# Altium schematic sheet 11 Power-DC IN.SchDoc: CM4 IO
size 420 x 297 mm; Page Create Date: March  8, 1995; Page Number: 11; Page Size: A3; Comment: radxa_1010; Page Count: 19; RevCode: V1.10; Doc: 11 Power-DC IN; DsnPath: D:\WMS\黄工\[RC126]CM4_IO_V1.10\[RC126]_V1.10\CM4 IO_V1.10.DSN; SchematicName: CM4 IO V1.10; PageName: 11 Power-DC IN; PageSize: A3; TopSchematic: True
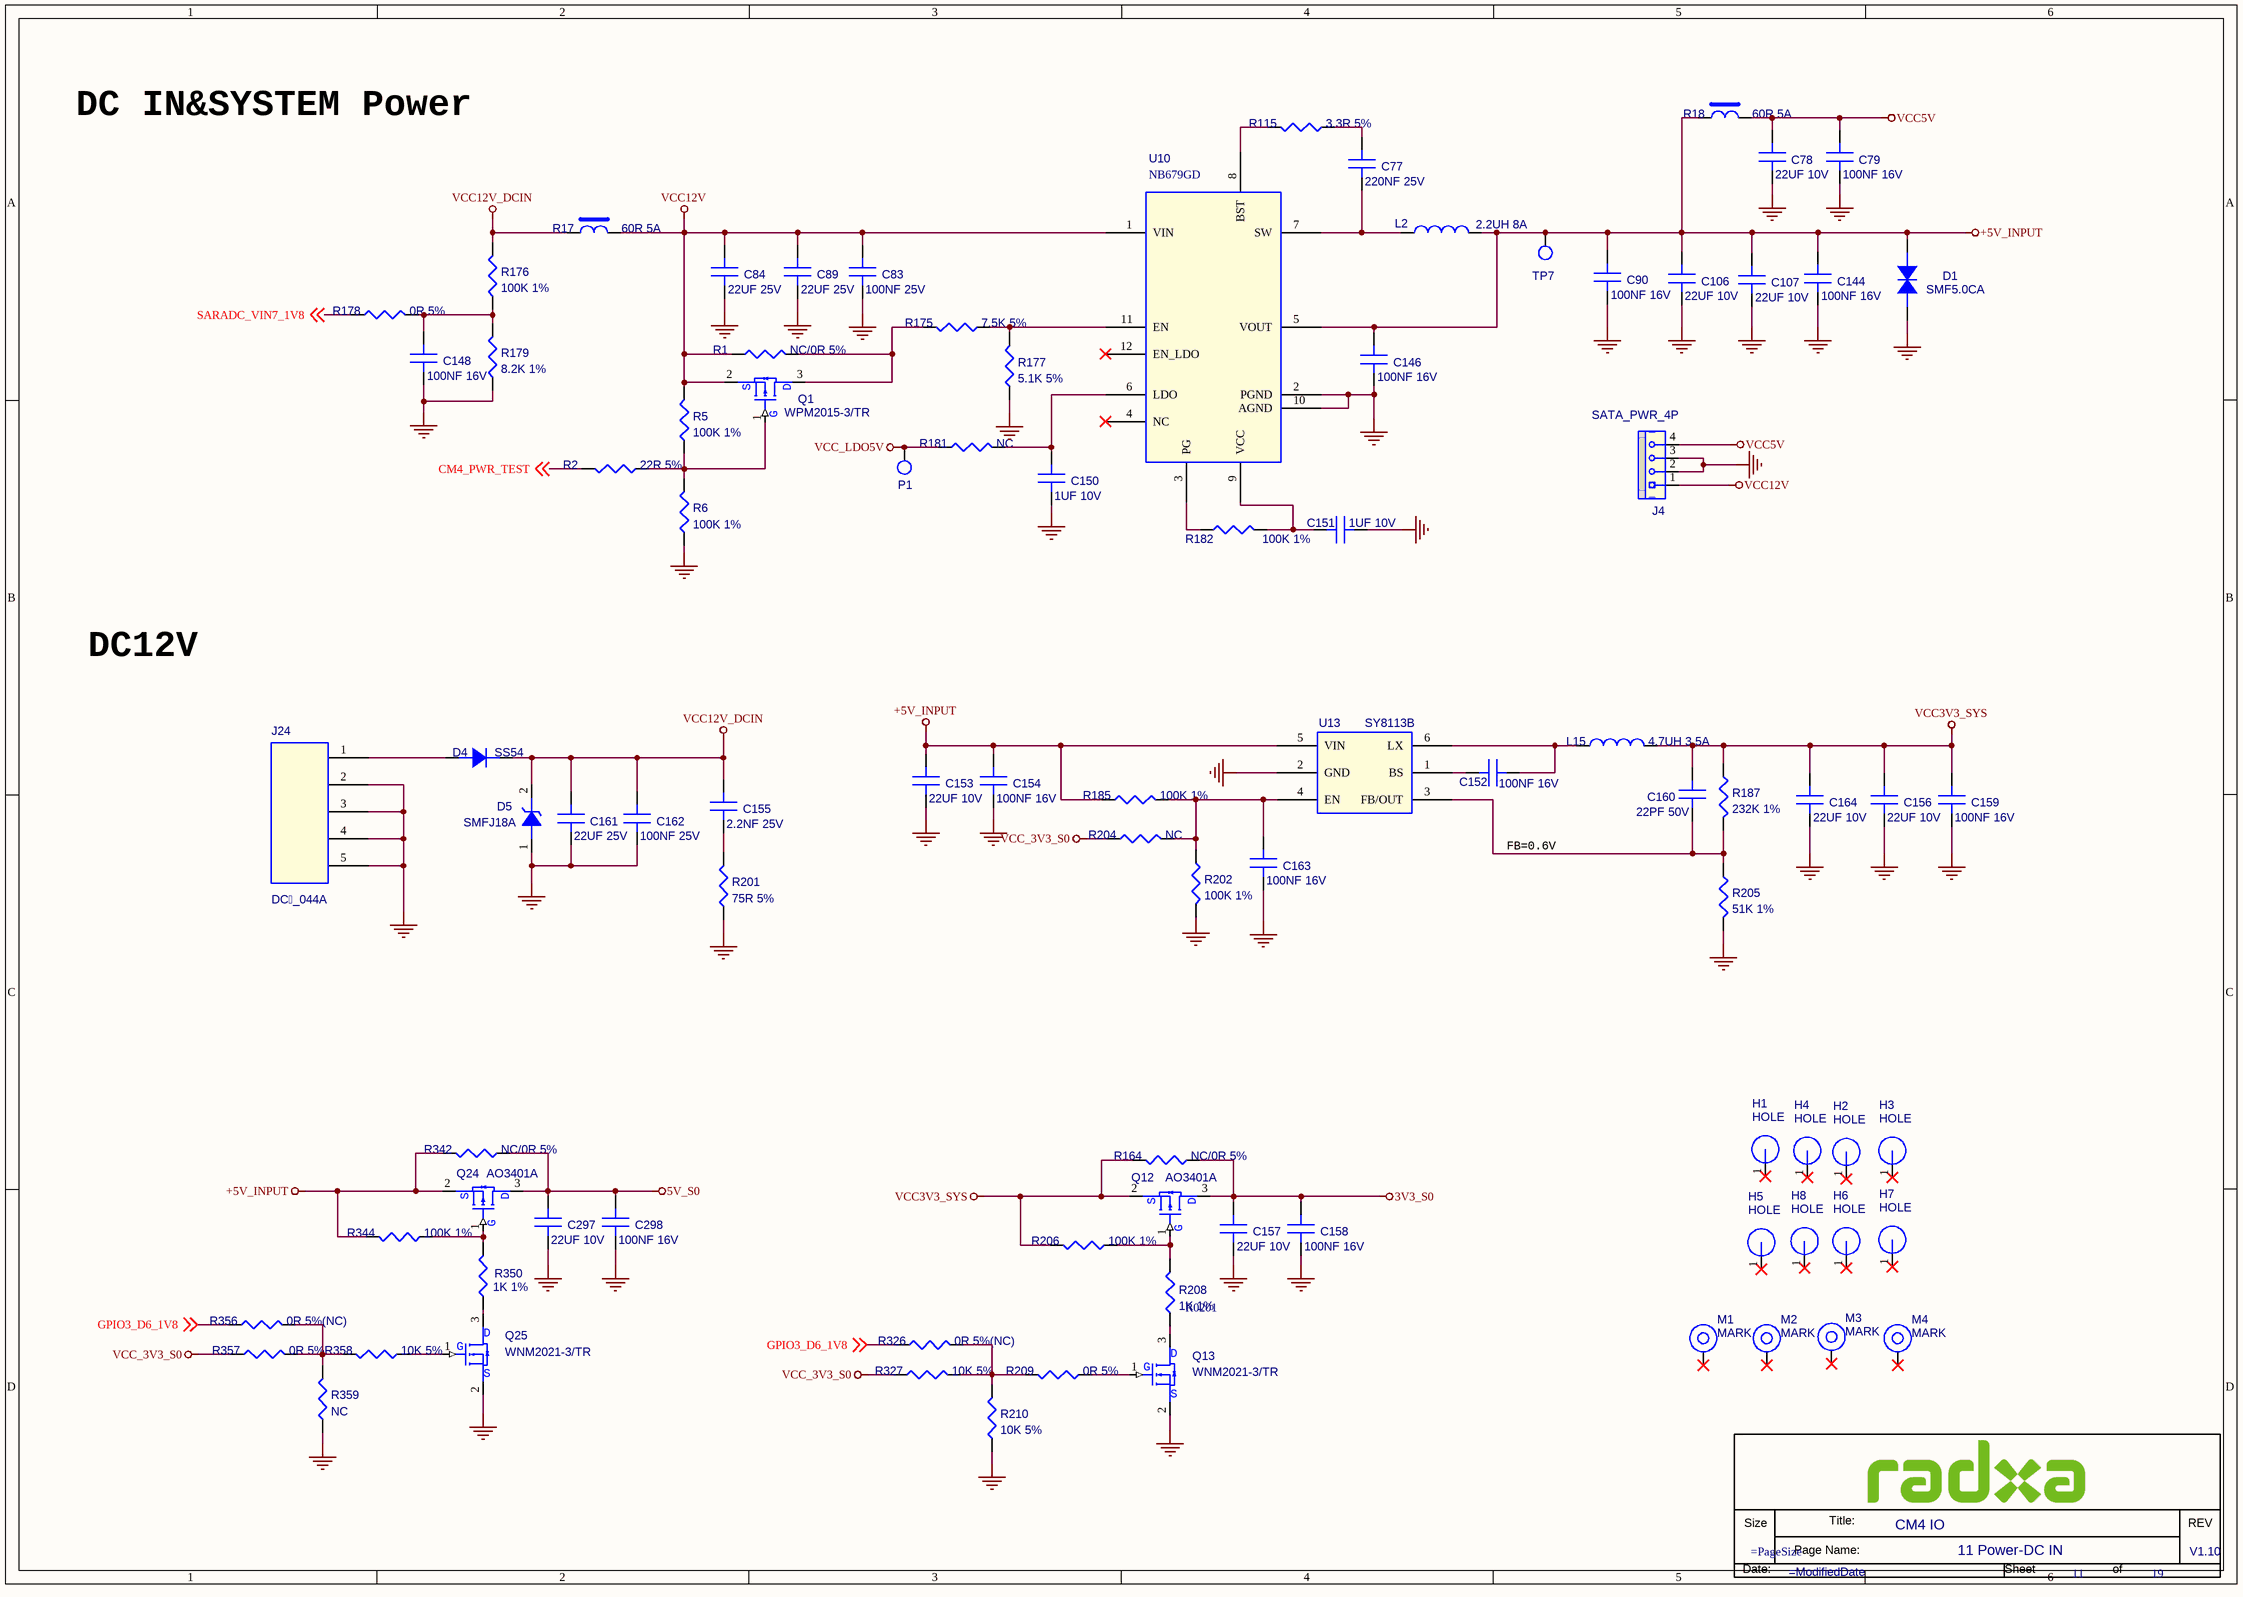
[diagram p0: 11 Power-DC IN.SchDoc]

## Parts
*  Doc: 11 Power-DC IN  RevCode: V1.10  Title: CM4 IO  Page Number: 11  Page Count: 19  (hidden comment: radxa_1010)  (graphical)
C77  220NF 25V  [C0201]
C78  22UF 10V  [C0603]
C79  100NF 16V  [C0201]
C83  100NF 25V  [C0201]
C84  22UF 25V  [C0805]
C89  22UF 25V  [C0805]
C90  100NF 16V  [C0201]
C106  22UF 10V  [C0603]
C107  22UF 10V  [C0603]
C144  100NF 16V  [C0201]
C146  100NF 16V  [C0201]
C148  100NF 16V  [C0201]
C150  1UF 10V  [C0201]
C151  1UF 10V  [C0201]
C152  100NF 16V  [C0201]
C153  22UF 10V  [C0603]
C154  100NF 16V  [C0201]
C155  2.2NF 25V  [C0201]
C156  22UF 10V  [C0603]
C157  22UF 10V  [C0603]
C158  100NF 16V  [C0201]
C159  100NF 16V  [C0201]
C160  22PF 50V  [C0201]
C161  22UF 25V  [C0805]
C162  100NF 25V  [C0201]
C163  100NF 16V  [C0201]
C164  22UF 10V  [C0603]
C297  22UF 10V  [C0603]
C298  100NF 16V  [C0201]
D1  SMF5.0CA  [SOD_123]
D4  SS54  [DO_214AC]
D5  SMFJ18A  [SOD_123]
H1  HOLE  [H3.8MM]
H2  HOLE  [H3.8MM]
H3  HOLE  [H3.8MM]
H4  HOLE  [H3.8MM]
H5  HOLE  [H3.8MM]
H6  HOLE  [H3.8MM]
H7  HOLE  [H3.8MM]
H8  HOLE  [H3.8MM]
J4  SATA_PWR_4P  [CON_TH1X4_2D54_SATA]
J24  DC_044A  [DC_TH5_12X10]
L2  2.2UH 8A  [L_6050]
L15  4.7UH 3.5A  [L_5020]
M1  MARK  [MARK]
M2  MARK  [MARK]
M3  MARK  [MARK]
M4  MARK  [MARK]
P1  TEST  [TEST]  (value not drawn)
Q1  WPM2015-3/TR  [SOT_23]
Q12  AO3401A  [SOT_23]
Q13  WNM2021-3/TR  [SOT_323]
Q24  AO3401A  [SOT_23]
Q25  WNM2021-3/TR  [SOT_323]
R1  NC/0R 5%  [R0402]
R2  22R 5%  [R0402]
R5  100K 1%  [R0402]
R6  100K 1%  [R0402]
R17  60R 5A  [FB1206]
R18  60R 5A  [FB1206]
R115  3.3R 5%  [R0402]
R164  NC/0R 5%  [R0402]
R175  7.5K 5%  [R0402]
R176  100K 1%  [R0402]
R177  5.1K 5%  [R0402]
R178  0R 5%  [R0402]
R179  8.2K 1%  [R0402]
R181  NC  [R0402]
R182  100K 1%  [R0402]
R185  100K 1%  [R0402]
R187  232K 1%  [R0402]
R201  75R 5%  [R0402]
R202  100K 1%  [R0402]
R204  NC  [R0402]
R205  51K 1%  [R0402]
R206  100K 1%  [R0402]
R208  1K 1%  PCB Footprint: R0201  [R0402]
R209  0R 5%  [R0402]
R210  10K 5%  [R0402]
R326  0R 5%(NC)  [R0402]
R327  10K 5%  [R0402]
R342  NC/0R 5%  [R0402]
R344  100K 1%  [R0402]
R350  1K 1%  [R0402]
R356  0R 5%(NC)  [R0402]
R357  0R 5%  [R0402]
R358  10K 5%  [R0402]
R359  NC  [R0402]
TP7  TP_0.7  [TEST]  (value not drawn)
U10  NB679GD  [QFN12_0D5_2]
U13  SY8113B  [SOT23_6]

## Nets
3V3_S0: C157.1(A) C158.1(A) Q12.3(D) R164.1
5V_S0: C297.1(A) C298.1(A) Q24.3(D) R342.1
+5V_INPUT: C90.1(A) C106.1(A) C107.1(A) C144.1(A) C146.1(A) C153.1(A) C154.1(A) D1.2(CATHODE) L2.2 Q24.2(S) R18.1 R185.1 R342.2 R344.2 TP7.1 U10.5(VOUT) U13.5(VIN)
GND: C78.2(B) C79.2(B) C83.2(B) C84.2(B) C89.2(B) C90.2(B) C106.2(B) C107.2(B) C144.2(B) C146.2(B) C148.2(B) C150.2(B) C151.2(B) C153.2(B) C154.2(B) C156.2(B) C157.2(B) C158.2(B) C159.2(B) C161.1(A) C162.2(B) C163.2(B) C164.2(B) C297.2(B) C298.2(B) D1.1(ANODE) D5.1(ANODE) J4.2 J4.3 J24.2 J24.3 J24.4 J24.5 Q13.2(S) Q25.2(S) R6.1 R177.1 R179.1 R201.1 R202.2 R205.2 R210.2 R359.2 U10.2(PGND) U10.10(AGND) U13.2(GND)
VCC3V3_SYS: C156.1(A) C159.1(A) C160.1(A) C164.1(A) L15.2 Q12.2(S) R164.2 R187.1 R206.2
VCC5V: C78.1(A) C79.1(A) J4.4 R18.2
VCC12V: C83.1(A) C84.1(A) C89.1(A) J4.1 Q1.2(S) R1.1 R5.2 R17.2 U10.1(VIN)
VCC12V_DCIN: C155.1(A) C161.2(B) C162.1(A) D4.2(K) D5.2(CATHODE) R17.1 R176.2
VCC_3V3_S0: R204.1 R327.1 R357.1
VCC_LDO5V: P1.1 R181.1
CM4_PWR_TEST: R2.1 ; off-sheet CM4_PWR_TEST
GPIO3_D6_1V8: R326.1 R356.1 ; off-sheet GPIO3_D6_1V8
SARADC_VIN7_1V8: R178.1 ; off-sheet SARADC_VIN7_1V8
NetC77_1: C77.1(A) R115.2
NetC77_2: C77.2(B) L2.1 U10.7(SW)
NetC148_1: C148.1(A) R176.1 R178.2 R179.2
NetC150_1: C150.1(A) R181.2 U10.6(LDO)
NetC151_1: C151.1(A) R182.2 U10.9(VCC)
NetC152_1: C152.1(A) U13.1(BS)
NetC152_2: C152.2(B) L15.1 U13.6(LX)
NetC155_2: C155.2(B) R201.2
NetC160_2: C160.2(B) R187.2 R205.1 U13.3(FB/OUT)
NetC163_1: C163.1(A) R185.2 R202.1 R204.2 U13.4(EN)
NetD4_1: D4.1(A) J24.1
NetQ1_1: Q1.1(G) R2.2 R5.1 R6.2
NetQ1_3: Q1.3(D) R1.2 R175.2
NetQ12_1: Q12.1(G) R206.1 R208.1
NetQ13_1: Q13.1(G) R209.1
NetQ13_3: Q13.3(D) R208.2
NetQ24_1: Q24.1(G) R344.1 R350.1
NetQ25_1: Q25.1(G) R358.1
NetQ25_3: Q25.3(D) R350.2
NetR115_1: R115.1 U10.8(BST)
NetR175_1: R175.1 R177.2 U10.11(EN)
NetR182_1: R182.1 U10.3(PG)
NetR209_2: R209.2 R210.1 R326.2 R327.2
NetR356_2: R356.2 R357.2 R358.2 R359.1

Not connected (* = marked no-connect by the designer): H1 1*; H2 1*; H3 1*; H4 1*; H5 1*; H6 1*; H7 1*; H8 1*; M1 1*; M2 1*; M3 1*; M4 1*; U10 4(NC)* 12(EN_LDO)*

## Notes on the sheet
- DC IN&SYSTEM Power
- DC12V
- FB=0.6V
- (in symbol radxa_1010) Size; Title:; REV; Page Name:; Date:; Sheet; of

## Library data of the parts
C77 = C: SMD  0201  220NF  25V  X5R  ±10%  ROHS; PARTS: 1; Part Reference: C77; Part Number: A1C01.00365; OriginalSymbolOrigin: (0,30); PKG_TYPE: CAP2-100-250; LEVEL: STD; PINSWAP: (A,B); Preferred: 6715f349cd0bc5; Value: 220NF 25V; Part Type: 陶瓷电容; PCB Footprint: C0201
C78 = C: SMD  0603  22UF  10V  X5R  ±20%  ROHS; PARTS: 1; Part Reference: C78; Part Number: A1C01.00015; OriginalSymbolOrigin: (0,30); PKG_TYPE: CAP2-100-250; LEVEL: STD; PINSWAP: (A,B); Preferred: 6715f349cd0bc5; Value: 22UF 10V; Part Type: 陶瓷电容; PCB Footprint: C0603
C79 = C: SMD  0201  100NF  16V  X5R  ±20%  ROHS; PARTS: 1; Part Reference: C79; Part Number: A1C01.00099; OriginalSymbolOrigin: (0,30); PKG_TYPE: CAP2-100-250; LEVEL: STD; PINSWAP: (A,B); Preferred: 6715f349cd0bc5; Value: 100NF 16V; Part Type: 陶瓷电容; PCB Footprint: C0201
C83 = C: SMD  0201  100NF  25V  X5R  ±20%  ROHS; PARTS: 1; Part Reference: C83; Part Number: A1C01.00101; OriginalSymbolOrigin: (0,30); PKG_TYPE: CAP2-100-250; LEVEL: STD; PINSWAP: (A,B); Preferred: 6715f349cd0bc5; Value: 100NF 25V; Part Type: 陶瓷电容; PCB Footprint: C0201
C84 = C: SMD  0805  22UF  25V  X5R  ±20%  ROHS; PARTS: 1; Part Reference: C84; Part Number: A1C01.00249; OriginalSymbolOrigin: (0,30); PKG_TYPE: CAP2-100-250; LEVEL: STD; PINSWAP: (A,B); Preferred: 6715f349cd0bc5; Value: 22UF 25V; Part Type: 陶瓷电容; PCB Footprint: C0805
C89 = C: SMD  0805  22UF  25V  X5R  ±20%  ROHS; PARTS: 1; Part Reference: C89; Part Number: A1C01.00249; OriginalSymbolOrigin: (0,30); PKG_TYPE: CAP2-100-250; LEVEL: STD; PINSWAP: (A,B); Preferred: 6715f349cd0bc5; Value: 22UF 25V; Part Type: 陶瓷电容; PCB Footprint: C0805
C90 = C: SMD  0201  100NF  16V  X5R  ±20%  ROHS; PARTS: 1; Part Reference: C90; Part Number: A1C01.00099; OriginalSymbolOrigin: (0,30); PKG_TYPE: CAP2-100-250; LEVEL: STD; PINSWAP: (A,B); Preferred: 6715f349cd0bc5; Value: 100NF 16V; Part Type: 陶瓷电容; PCB Footprint: C0201
C106 = C: SMD  0603  22UF  10V  X5R  ±20%  ROHS; PARTS: 1; Part Reference: C106; Part Number: A1C01.00015; OriginalSymbolOrigin: (0,30); PKG_TYPE: CAP2-100-250; LEVEL: STD; PINSWAP: (A,B); Preferred: 6715f349cd0bc5; Value: 22UF 10V; Part Type: 陶瓷电容; PCB Footprint: C0603
C107 = C: SMD  0603  22UF  10V  X5R  ±20%  ROHS; PARTS: 1; Part Reference: C107; Part Number: A1C01.00015; OriginalSymbolOrigin: (0,30); PKG_TYPE: CAP2-100-250; LEVEL: STD; PINSWAP: (A,B); Preferred: 6715f349cd0bc5; Value: 22UF 10V; Part Type: 陶瓷电容; PCB Footprint: C0603
C144 = C: SMD  0201  100NF  16V  X5R  ±20%  ROHS; PARTS: 1; Part Reference: C144; Part Number: A1C01.00099; OriginalSymbolOrigin: (0,30); PKG_TYPE: CAP2-100-250; LEVEL: STD; PINSWAP: (A,B); Preferred: 6715f349cd0bc5; Value: 100NF 16V; Part Type: 陶瓷电容; PCB Footprint: C0201
C146 = C: SMD  0201  100NF  16V  X5R  ±20%  ROHS; PARTS: 1; Part Reference: C146; Part Number: A1C01.00099; OriginalSymbolOrigin: (0,30); PKG_TYPE: CAP2-100-250; LEVEL: STD; PINSWAP: (A,B); Preferred: 6715f349cd0bc5; Value: 100NF 16V; Part Type: 陶瓷电容; PCB Footprint: C0201
C148 = C: SMD  0201  100NF  16V  X5R  ±20%  ROHS; PARTS: 1; Part Reference: C148; Part Number: A1C01.00099; OriginalSymbolOrigin: (0,30); PKG_TYPE: CAP2-100-250; LEVEL: STD; PINSWAP: (A,B); Preferred: 6715f349cd0bc5; Value: 100NF 16V; Part Type: 陶瓷电容; PCB Footprint: C0201
C150 = C: SMD  0201  1UF  10V  X5R  ±20%  ROHS; PARTS: 1; Part Reference: C150; Part Number: A1C01.00081; OriginalSymbolOrigin: (0,30); PKG_TYPE: CAP2-100-250; LEVEL: STD; PINSWAP: (A,B); Preferred: 6715f349cd0bc5; Value: 1UF 10V; Part Type: 陶瓷电容; PCB Footprint: C0201
C151 = C: SMD  0201  1UF  10V  X5R  ±20%  ROHS; PARTS: 1; Part Reference: C151; Part Number: A1C01.00081; OriginalSymbolOrigin: (0,30); PKG_TYPE: CAP2-100-250; LEVEL: STD; PINSWAP: (A,B); Preferred: 6715f349cd0bc5; Value: 1UF 10V; Part Type: 陶瓷电容
C152 = C: SMD  0201  100NF  16V  X5R  ±20%  ROHS; PARTS: 1; Part Reference: C152; Part Number: A1C01.00099; OriginalSymbolOrigin: (0,30); PKG_TYPE: CAP2-100-250; LEVEL: STD; PINSWAP: (A,B); Preferred: 6715f349cd0bc5; Value: 100NF 16V; Part Type: 陶瓷电容; PCB Footprint: C0201
C153 = C: SMD  0603  22UF  10V  X5R  ±20%  ROHS; PARTS: 1; Part Reference: C153; Part Number: A1C01.00015; OriginalSymbolOrigin: (0,30); PKG_TYPE: CAP2-100-250; LEVEL: STD; PINSWAP: (A,B); Preferred: 6715f349cd0bc5; Value: 22UF 10V; Part Type: 陶瓷电容; PCB Footprint: C0603
C154 = C: SMD  0201  100NF  16V  X5R  ±20%  ROHS; PARTS: 1; Part Reference: C154; Part Number: A1C01.00099; OriginalSymbolOrigin: (0,30); PKG_TYPE: CAP2-100-250; LEVEL: STD; PINSWAP: (A,B); Preferred: 6715f349cd0bc5; Value: 100NF 16V; Part Type: 陶瓷电容; PCB Footprint: C0201
C155 = C: SMD  0201  2.2NF  25V  X7R  ±10%  ROHS; PARTS: 1; Part Reference: C155; Part Number: A1C01.00123; OriginalSymbolOrigin: (0,30); PKG_TYPE: CAP2-100-250; LEVEL: STD; PINSWAP: (A,B); Preferred: 6715f349cd0bc5; Value: 2.2NF 25V; Part Type: 陶瓷电容; PCB Footprint: C0201
C156 = C: SMD  0603  22UF  10V  X5R  ±20%  ROHS; PARTS: 1; Part Reference: C156; Part Number: A1C01.00015; OriginalSymbolOrigin: (0,30); PKG_TYPE: CAP2-100-250; LEVEL: STD; PINSWAP: (A,B); Preferred: 6715f349cd0bc5; Value: 22UF 10V; Part Type: 陶瓷电容; PCB Footprint: C0603
C157 = C: SMD  0603  22UF  10V  X5R  ±20%  ROHS; PARTS: 1; Part Reference: C157; Part Number: A1C01.00015; OriginalSymbolOrigin: (0,30); PKG_TYPE: CAP2-100-250; LEVEL: STD; PINSWAP: (A,B); Preferred: 6715f349cd0bc5; Value: 22UF 10V; Part Type: 陶瓷电容; PCB Footprint: C0603
C158 = C: SMD  0201  100NF  16V  X5R  ±20%  ROHS; PARTS: 1; Part Reference: C158; Part Number: A1C01.00099; OriginalSymbolOrigin: (0,30); PKG_TYPE: CAP2-100-250; LEVEL: STD; PINSWAP: (A,B); Preferred: 6715f349cd0bc5; Value: 100NF 16V; Part Type: 陶瓷电容; PCB Footprint: C0201
C159 = C: SMD  0201  100NF  16V  X5R  ±20%  ROHS; PARTS: 1; Part Reference: C159; Part Number: A1C01.00099; OriginalSymbolOrigin: (0,30); PKG_TYPE: CAP2-100-250; LEVEL: STD; PINSWAP: (A,B); Preferred: 6715f349cd0bc5; Value: 100NF 16V; Part Type: 陶瓷电容; PCB Footprint: C0201
C160 = C: SMD  0201  22PF  50V  NPO  ±5%  ROHS; PARTS: 1; Part Reference: C160; Part Number: A1C01.00021; OriginalSymbolOrigin: (0,30); PKG_TYPE: CAP2-100-250; LEVEL: STD; PINSWAP: (A,B); Preferred: 6715f349cd0bc5; Value: 22PF 50V; Part Type: 陶瓷电容; PCB Footprint: C0201
C161 = C: SMD  0805  22UF  25V  X5R  ±20%  ROHS; PARTS: 1; Part Reference: C161; Part Number: A1C01.00249; OriginalSymbolOrigin: (0,30); PKG_TYPE: CAP2-100-250; LEVEL: STD; PINSWAP: (A,B); Preferred: 6715f349cd0bc5; Value: 22UF 25V; Part Type: 陶瓷电容; PCB Footprint: C0805
C162 = C: SMD  0201  100NF  25V  X5R  ±20%  ROHS; PARTS: 1; Part Reference: C162; Part Number: A1C01.00101; OriginalSymbolOrigin: (0,30); PKG_TYPE: CAP2-100-250; LEVEL: STD; PINSWAP: (A,B); Preferred: 6715f349cd0bc5; Value: 100NF 25V; Part Type: 陶瓷电容; PCB Footprint: C0201
C163 = C: SMD  0201  100NF  16V  X5R  ±20%  ROHS; PARTS: 1; Part Reference: C163; Part Number: A1C01.00099; OriginalSymbolOrigin: (0,30); PKG_TYPE: CAP2-100-250; LEVEL: STD; PINSWAP: (A,B); Preferred: 6715f349cd0bc5; Value: 100NF 16V; Part Type: 陶瓷电容; PCB Footprint: C0201
C164 = C: SMD  0603  22UF  10V  X5R  ±20%  ROHS; PARTS: 1; Part Reference: C164; Part Number: A1C01.00015; OriginalSymbolOrigin: (0,30); PKG_TYPE: CAP2-100-250; LEVEL: STD; PINSWAP: (A,B); Preferred: 6715f349cd0bc5; Value: 22UF 10V; Part Type: 陶瓷电容; PCB Footprint: C0603
C297 = C: SMD  0603  22UF  10V  X5R  ±20%  ROHS; PARTS: 1; Part Reference: C297; Part Number: A1C01.00015; OriginalSymbolOrigin: (0,30); PKG_TYPE: CAP2-100-250; LEVEL: STD; PINSWAP: (A,B); Preferred: 6715f349cd0bc5; Value: 22UF 10V; Part Type: 陶瓷电容; PCB Footprint: C0603
C298 = C: SMD  0201  100NF  16V  X5R  ±20%  ROHS; PARTS: 1; Part Reference: C298; Part Number: A1C01.00099; OriginalSymbolOrigin: (0,30); PKG_TYPE: CAP2-100-250; LEVEL: STD; PINSWAP: (A,B); Preferred: 6715f349cd0bc5; Value: 100NF 16V; Part Type: 陶瓷电容; PCB Footprint: C0201
D1 = DIODE_S: SMD  SOD-123FL  SMF5.0CA  晶导微  ROHS; Part Reference: D1; Part Number: A1D02.00132; Temp Coeff: -55℃ to +150℃; Value: SMF5.0CA; Part Type: 二极管-ESD管-桥堆-TVS管; PCB Footprint: SOD_123
D4 = DIODE: SMD  编带  DO-214AC  SS54  晶导微  ROHS; Part Reference: D4; Manufacturer PN: SS32; Manufacturer: 星海; Part Number: A1D02.00006; Priority: A; ROOM: CHG; Value: SS54; Created by: JJJ; Part Type: 二极管-ESD管-桥堆-TVS管; RK PN: SS32; PCB Footprint: DO_214AC
D5 = TVS: SMD  编带  SOD-123  SMFJ18A  晶导微电子  ROHS; Part Reference: D5; Part Number: A1D02.00007; Preferred: 6715f349cd0bc5; Temp Coeff: -55℃ to +150℃; PCB Footprint: SOD_123; Value: SMFJ18A; Part Type: 二极管-ESD管-桥堆-TVS管
H1 = HOLE: 直径3.5mm hole; Part Reference: H1; PCB Footprint: HOLE_R6_2D7MM; RK PN: HOLE_3R50; Priority: A; Value: HOLE; Part Type: HOLE; Created by: CZD
H2 = HOLE: 直径3.5mm hole; Part Reference: H2; PCB Footprint: HOLE_R6_2D7MM; Priority: A; RK PN: HOLE_3R50; Value: HOLE; Created by: CZD; Part Type: HOLE
H3 = HOLE: 直径3.5mm hole; Part Reference: H3; PCB Footprint: HOLE_R6_2D7MM; Priority: A; RK PN: HOLE_3R50; Value: HOLE; Created by: CZD; Part Type: HOLE
H4 = HOLE: 直径3.5mm hole; Part Reference: H4; PCB Footprint: HOLE_R6_2D7MM; Priority: A; RK PN: HOLE_3R50; Value: HOLE; Created by: CZD; Part Type: HOLE
H5 = HOLE: 直径3.5mm hole; Part Reference: H5; PCB Footprint: HOLE_R6_2D7MM; RK PN: HOLE_3R50; Priority: A; Value: HOLE; Part Type: HOLE; Created by: CZD
H6 = HOLE: 直径3.5mm hole; Part Reference: H6; PCB Footprint: HOLE_R6_2D7MM; RK PN: HOLE_3R50; Priority: A; Value: HOLE; Part Type: HOLE; Created by: CZD
H7 = HOLE: 直径3.5mm hole; Part Reference: H7; PCB Footprint: HOLE_R6_2D7MM; Priority: A; RK PN: HOLE_3R50; Value: HOLE; Created by: CZD; Part Type: HOLE
H8 = HOLE: 直径3.5mm hole; Part Reference: H8; PCB Footprint: HOLE_R6_2D7MM; Priority: A; RK PN: HOLE_3R50; Value: HOLE; Created by: CZD; Part Type: HOLE
J4 = SATA_PWR_4P: DIP  排针座  1*4PIN  180度  无定位柱  2.54mm脚距  针长一端8.3mm  另一端3.5mm  小4PIN  白色  M2545V-4P  兴飞  ROHS; Part Reference: J4; Part Number: A1J01.00014; Value: SATA_PWR_4P; Part Type: 排座
J24 = DC_044A_5520: DIP  5PIN  DS-044BS  内孔Φ6mm  铁芯Φ2.0mm  11.6*10.2*7.3mm  协佳  ROHS; Part Reference: J24; Part Number: A1J11.00007; Temp Coeff: NA; Preferred: 6715f352cd0bcd; Part Type: DC座
L2 = L: SMD  带屏蔽  7.2x6.6x5mm  2.2UH  8A  ±20%  RXWSHC0650-2R2M  仁芯微  ROHS; Part Reference: L2; Part Number: A1L01.00163; Preferred: 6715f349cd0bc5; Temp Coeff: -55℃ to +125℃; PCB Footprint: L_6050; Value: 2.2UH 8A; Part Type: 贴片功率电感
L15 = L: SMD  带屏蔽  5.4*5.2*1.8mm  4.7UH  3.5A  ±20%  RXWSHC0520-4R7M  仁芯微  ROHS; Part Reference: L15; Part Number: A1L01.00071; Preferred: 6715f349cd0bc5; Temp Coeff: -55℃ to +125℃; PCB Footprint: L_5020; Value: 4.7UH 3.5A; Part Type: 贴片功率电感
M1 = MARK: MARK Symble; Part Reference: M1; Priority: A; RK PN: MARK01; PCB Footprint: MARK; Value: MARK; Created by: JJJ; Part Type: MARK
M2 = MARK: MARK Symble; Part Reference: M2; Priority: A; RK PN: MARK01; PCB Footprint: MARK; Value: MARK; Created by: JJJ; Part Type: MARK
M3 = MARK: MARK Symble; Part Reference: M3; RK PN: MARK01; Priority: A; PCB Footprint: MARK; Value: MARK; Part Type: MARK; Created by: JJJ
M4 = MARK: MARK Symble; Part Reference: M4; RK PN: MARK01; Priority: A; PCB Footprint: MARK; Value: MARK; Part Type: MARK; Created by: JJJ
P1 = TESTPOINT1: Part Reference: P1; PCB Footprint: TP_0R70; Value: TEST
Q1 = MOSFET_PNP: SMD编带  SOT-23  WPM2015-3/TR  P沟道  ROHS; Part Reference: Q1; Part Number: A1D01.00019; Temp Coeff: -55℃ to ＋150℃; Value: WPM2015-3/TR; Part Type: 三极管-MOS管; PCB Footprint: SOT_23
Q12 = MOSFET_PNP: SMD  编带  SOT23-3  AO3401A  P沟道  AOS  ROHS; Part Reference: Q12; Part Number: A1D01.00034; Temp Coeff: -55℃ to ＋150℃; Value: AO3401A; Part Type: 三极管-MOS管; PCB Footprint: SOT_23
Q13 = MOSFET_NPN: SMD编带  SOT-323  WILLSEMI(韦尔)  WNM2021-3/TR  N沟道  ROHS; Part Reference: Q13; Part Number: A1D01.00008; Temp Coeff: -55℃ to ＋150℃; Value: WNM2021-3/TR; Part Type: 三极管-MOS管; PCB Footprint: SOT_323
Q24 = MOSFET_PNP: SMD  编带  SOT23-3  AO3401A  P沟道  AOS  ROHS; Part Reference: Q24; Part Number: A1D01.00034; Temp Coeff: -55℃ to ＋150℃; Value: AO3401A; Part Type: 三极管-MOS管; PCB Footprint: SOT_23
Q25 = MOSFET_NPN: SMD编带  SOT-323  WILLSEMI(韦尔)  WNM2021-3/TR  N沟道  ROHS; Part Reference: Q25; Part Number: A1D01.00008; Temp Coeff: -55℃ to ＋150℃; Value: WNM2021-3/TR; Part Type: 三极管-MOS管; PCB Footprint: SOT_323
R1 = R: SMD  0201  0R  1/20W  ±5%  ROHS; Part Reference: R1; Part Number: A1R01.00027; PCB Footprint: R0201; Temp Coeff: -55℃ to +125℃; Preferred: 6715f349cd0bc5; Value: NC/0R 5%; Part Type: 贴片电阻
R2 = R: SMD  0201  22R  1/20W  ±5%  ROHS; Part Reference: R2; Part Number: A1R01.00024; PCB Footprint: R0201; Preferred: 6715f349cd0bc5; Temp Coeff: -55℃ to +125℃; Value: 22R 5%; Part Type: 贴片电阻
R5 = R: SMD  0201  100K  1/20W  ±1%  ROHS; Part Reference: R5; Part Number: A1R01.00165; PCB Footprint: R0201; Preferred: 6715f349cd0bc5; Value: 100K 1%; Part Type: 贴片电阻
R6 = R: SMD  0201  100K  1/20W  ±1%  ROHS; Part Reference: R6; Part Number: A1R01.00165; PCB Footprint: R0201; Preferred: 6715f349cd0bc5; Value: 100K 1%; Part Type: 贴片电阻
R17 = BEAD: SMD  1206  FB60R  5A  ±25%  ROHS; Part Reference: R17; Part Number: A1L09.00006; Preferred: 6715f352cd0bcd; Temp Coeff: -40℃ to +105℃; PCB Footprint: FB1206; Value: 60R 5A; Part Type: 贴片磁珠
R18 = BEAD: SMD  1206  FB60R  5A  ±25%  ROHS; Part Reference: R18; Part Number: A1L09.00006; Preferred: 6715f352cd0bcd; Temp Coeff: -40℃ to +105℃; PCB Footprint: FB1206; Value: 60R 5A; Part Type: 贴片磁珠
R115 = R: SMD  0201  3.3R  1/20W  ±5%  ROHS; Part Reference: R115; Part Number: A1R01.00145; PCB Footprint: R0201; Preferred: 6715f349cd0bc5; Temp Coeff: -55℃ to +125℃; Value: 3.3R 5%; Part Type: 贴片电阻
R164 = R: SMD  0402  0R  1/16W  ±5%  ROHS; Part Reference: R164; Part Number: A1R01.00030; Temp Coeff: -55℃ to +155℃; Preferred: 6715f349cd0bc5; PCB Footprint: R0402; Value: NC/0R 5%; Part Type: 贴片电阻
R175 = R: SMD  0201  7.5K  1/20W  ±5%  ROHS; Part Reference: R175; Part Number: A1R01.00495; PCB Footprint: R0201; Temp Coeff: -55℃ to +125℃; Preferred: 6715f349cd0bc5; Value: 7.5K 5%; Part Type: 贴片电阻
R176 = R: SMD  0201  100K  1/20W  ±1%  ROHS; Part Reference: R176; Part Number: A1R01.00165; Preferred: 6715f349cd0bc5; Value: 100K 1%; Part Type: 贴片电阻
R177 = R: SMD  0201  5.1K  1/20W  ±5%  ROHS; Part Reference: R177; Part Number: A1R01.00013; PCB Footprint: R0201; Temp Coeff: -55℃ to +125℃; Preferred: 6715f349cd0bc5; Value: 5.1K 5%; Part Type: 贴片电阻
R178 = R: SMD  0201  0R  1/20W  ±5%  ROHS; Part Reference: R178; Part Number: A1R01.00027; PCB Footprint: R0201; Temp Coeff: -55℃ to +125℃; Preferred: 6715f349cd0bc5; Value: 0R 5%; Part Type: 贴片电阻
R179 = R: SMD  0201  8.2K  1/20W  ±1%  ROHS; Part Reference: R179; Part Number: A1R01.00086; PCB Footprint: R0201; Preferred: 6715f349cd0bc5; Temp Coeff: -55℃ to +125℃; Value: 8.2K 1%; Part Type: 贴片电阻
R181 = R: SMD  0201  0R  1/20W  ±5%  ROHS; Part Reference: R181; Part Number: A1R01.00027; PCB Footprint: R0201; Preferred: 6715f349cd0bc5; Temp Coeff: -55℃ to +125℃; Value: NC; Part Type: 贴片电阻
R182 = R: SMD  0201  100K  1/20W  ±1%  ROHS; Part Reference: R182; Part Number: A1R01.00165; PCB Footprint: R0201; Preferred: 6715f349cd0bc5; Value: 100K 1%; Part Type: 贴片电阻
R185 = R: SMD  0201  100K  1/20W  ±1%  ROHS; Part Reference: R185; Part Number: A1R01.00165; PCB Footprint: R0201; Preferred: 6715f349cd0bc5; Value: 100K 1%; Part Type: 贴片电阻
R187 = R: SMD  0201  232K  1/20W  ±1%  ROHS; Part Reference: R187; Part Number: A1R01.00189; PCB Footprint: R0201; Preferred: 6715f349cd0bc5; Temp Coeff: -55℃ to +125℃; Value: 232K 1%; Part Type: 贴片电阻
R201 = R: SMD  0201  75R  1/20W  ±5%  ROHS; Part Reference: R201; Part Number: A1R01.00395; PCB Footprint: R0201; Temp Coeff: -55℃ to +125℃; Preferred: 6715f349cd0bc5; Value: 75R 5%; Part Type: 贴片电阻
R202 = R: SMD  0201  100K  1/20W  ±1%  ROHS; Part Reference: R202; Part Number: A1R01.00165; PCB Footprint: R0201; Preferred: 6715f349cd0bc5; Value: 100K 1%; Part Type: 贴片电阻
R204 = R: SMD  0201  10K  1/20W  ±5%  ROHS; Part Reference: R204; Part Number: A1R01.00012; PCB Footprint: R0201; Preferred: 6715f349cd0bc5; Temp Coeff: -55℃ to +125℃; Value: NC; Part Type: 贴片电阻
R205 = R: SMD  0201  51K  1/20W  ±1%  ROHS; Part Reference: R205; Part Number: A1R01.00149; PCB Footprint: R0201; Preferred: 6715f349cd0bc5; Temp Coeff: -55℃ to +125℃; Value: 51K 1%; Part Type: 贴片电阻
R206 = R: SMD  0201  100K  1/20W  ±1%  ROHS; Part Reference: R206; Part Number: A1R01.00165; PCB Footprint: R0201; Preferred: 6715f349cd0bc5; Value: 100K 1%; Part Type: 贴片电阻
R208 = R: SMD  0201  1K  1/20W  ±1%  ROHS; Part Reference: R208; Part Number: A1R01.00111; Preferred: 6715f349cd0bc5; Value: 1K 1%; Part Type: 贴片电阻
R209 = R: SMD  0201  10K  1/20W  ±5%  ROHS; Part Reference: R209; Part Number: A1R01.00012; PCB Footprint: R0201; Preferred: 6715f349cd0bc5; Temp Coeff: -55℃ to +125℃; Value: 0R 5%; Part Type: 贴片电阻
R210 = R: SMD  0201  10K  1/20W  ±5%  ROHS; Part Reference: R210; Part Number: A1R01.00012; PCB Footprint: R0201; Preferred: 6715f349cd0bc5; Temp Coeff: -55℃ to +125℃; Value: 10K 5%; Part Type: 贴片电阻
R326 = R: SMD  0201  0R  1/20W  ±5%  ROHS; Part Reference: R326; Part Number: A1R01.00027; PCB Footprint: R0201; Preferred: 6715f349cd0bc5; Temp Coeff: -55℃ to +125℃; Value: 0R 5%(NC); Part Type: 贴片电阻
R327 = R: SMD  0201  0R  1/20W  ±5%  ROHS; Part Reference: R327; Part Number: A1R01.00027; PCB Footprint: R0201; Temp Coeff: -55℃ to +125℃; Preferred: 6715f349cd0bc5; Value: 10K 5%; Part Type: 贴片电阻
R342 = R: SMD  0402  0R  1/16W  ±5%  ROHS; Part Reference: R342; Part Number: A1R01.00030; Temp Coeff: -55℃ to +155℃; Preferred: 6715f349cd0bc5; PCB Footprint: R0402; Value: NC/0R 5%; Part Type: 贴片电阻
R344 = R: SMD  0201  100K  1/20W  ±1%  ROHS; Part Reference: R344; Part Number: A1R01.00165; PCB Footprint: R0201; Preferred: 6715f349cd0bc5; Value: 100K 1%; Part Type: 贴片电阻
R350 = R: SMD  0201  1K  1/20W  ±1%  ROHS; Part Reference: R350; Part Number: A1R01.00111; PCB Footprint: R0201; Preferred: 6715f349cd0bc5; Value: 1K 1%; Part Type: 贴片电阻
R356 = R: SMD  0201  0R  1/20W  ±5%  ROHS; Part Reference: R356; Part Number: A1R01.00027; PCB Footprint: R0201; Temp Coeff: -55℃ to +125℃; Preferred: 6715f349cd0bc5; Value: 0R 5%(NC); Part Type: 贴片电阻
R357 = R: SMD  0201  0R  1/20W  ±5%  ROHS; Part Reference: R357; Part Number: A1R01.00027; PCB Footprint: R0201; Temp Coeff: -55℃ to +125℃; Preferred: 6715f349cd0bc5; Value: 0R 5%; Part Type: 贴片电阻
R358 = R: SMD  0201  10K  1/20W  ±5%  ROHS; Part Reference: R358; Part Number: A1R01.00012; PCB Footprint: R0201; Temp Coeff: -55℃ to +125℃; Preferred: 6715f349cd0bc5; Value: 10K 5%; Part Type: 贴片电阻
R359 = R: SMD  0201  10K  1/20W  ±5%  ROHS; Part Reference: R359; Part Number: A1R01.00012; PCB Footprint: R0201; Preferred: 6715f349cd0bc5; Temp Coeff: -55℃ to +125℃; Value: NC; Part Type: 贴片电阻
TP7 = TP: Test Point 0.7mm; Part Reference: TP7; PCB Footprint: TP_0R70; Priority: A; RK PN: TESTPOINT_0R7; Value: TP_0.7; Created by: JJJ; Part Type: TP
U10 = NB679: SMD  DCDC  NB679GD-Z  QFN12  MPS  ROHS; Part Reference: U10; Part Number: A1I01.00033; Preferred: 6715f349cd0bc5; Temp Coeff: -40°C to +125°C; PCB Footprint: QFN12_0D5_2; Value: NB679GD; Part Type: 集成电路/模块
U13 = SY8113B: SMD  DCDC  SY8113BADC  SOT23-6  silergy(矽力杰)  ROHS; Part Reference: U13; Part Number: A1I01.00093; Preferred: 6715f349cd0bc5; Temp Coeff: -40℃ to +85℃; PCB Footprint: SOT23_6; Value: SY8113B; Part Type: 集成电路/模块
* = radxa_1010: Page Create Date: March  8, 1995; Page Size: =PageSize; Page Modify Date: =ModifiedDate